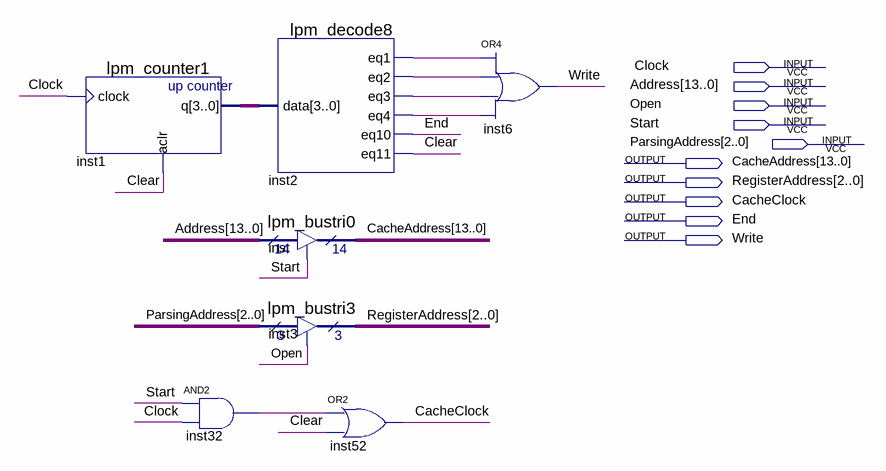
[diagram p0: schematic sheet]
// Quartus schematic MoveAddressRegister.bdf as structural Verilog: 7 symbols, 10 pins
module MoveAddressRegister (
  input  Clock,
  input  [13:0] Address,
  input  Open,
  input  Start,
  input  [2:0] ParsingAddress,
  output [13:0] CacheAddress,
  output [2:0] RegisterAddress,
  output CacheClock,
  output End,
  output Write
);

  wire Clear, inst2_eq1, inst2_eq2, inst2_eq3, inst2_eq4, inst32_out;
  wire [3:0] inst1_q;

  lpm_counter1 inst1 (.clock(Clock), .aclr(Clear), .q(inst1_q));
  and inst32 (inst32_out, Start, Clock);
  lpm_decode8 inst2 (
    .data(inst1_q), .eq1(inst2_eq1), .eq2(inst2_eq2), .eq3(inst2_eq3), .eq4(inst2_eq4), .eq10(End),
    .eq11(Clear));
  lpm_bustri0 inst (.enabledt(Start), .data(Address), .tridata(CacheAddress));
  lpm_bustri3 inst3 (.enabledt(Open), .data(ParsingAddress), .tridata(RegisterAddress));
  or inst52 (CacheClock, inst32_out, Clear);
  or inst6 (Write, inst2_eq1, inst2_eq2, inst2_eq3, inst2_eq4);
endmodule
